# Altium project Notecarrier-XI_V4.PrjPCB
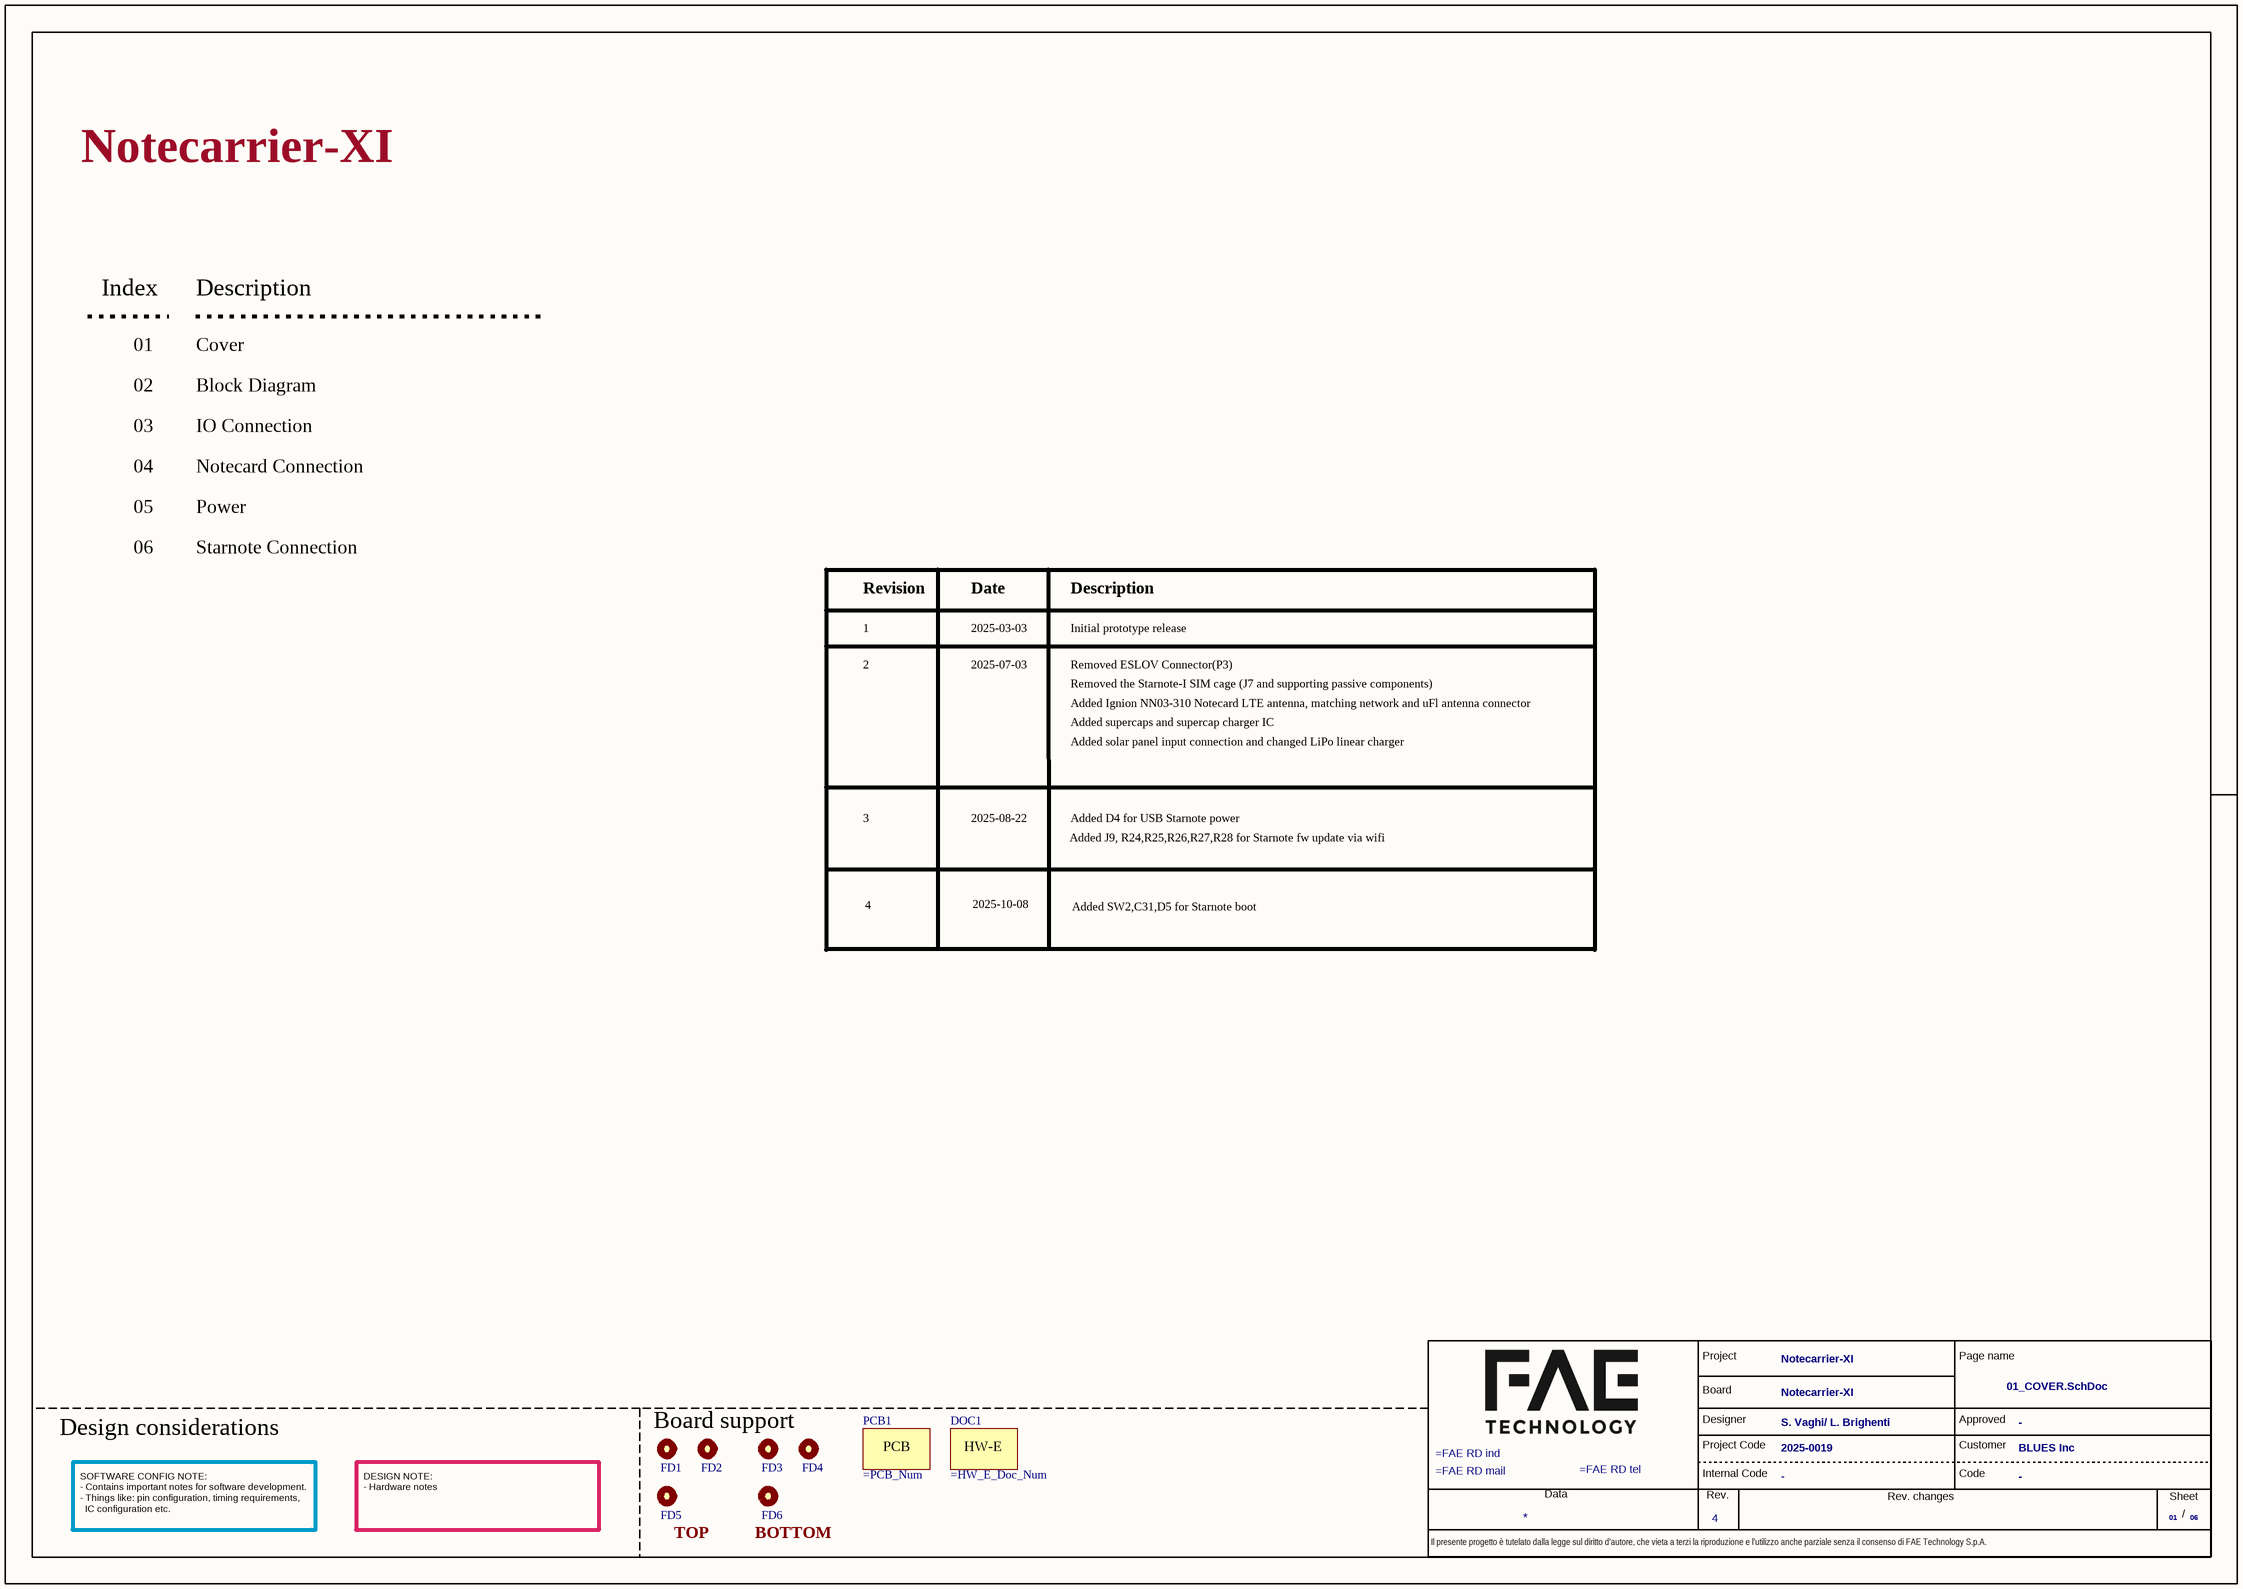
[diagram p0: 01_COVER.SchDoc]
Customer Code: -; Customer name: BLUES Inc; Database: -; FAE RD Code: 2025-0019; Nome Progetto: Notecarrier-XI; PageTotal: 06; Project designer: S. Vaghi/ L. Brighenti; Project Manager: -; Rev: 4; Schematic Name: Notecarrier-XI
5 sheets, 70 parts. Net scope: global (net labels, ports and power ports of the same name join across sheets).
Board file: Notecarrier-XI_V4.PcbDoc
Sheets:
  01_COVER.SchDoc
  02_BLOCK-DIAGRAM.SchDoc
  03_IO-CONNECTION.SchDoc
  04_NOTECARD-CONNECTION.SchDoc
  06_STARNOTE-CONNECTION.SchDoc

## Sheet 01_COVER.SchDoc
size 420 x 297 mm; Web: www.byte-lab.com; PageNumber: 01

### Parts
(Parts that share a designator on the sheet are numbered #1, #2 ... from top to bottom, then left to right.)
?#1  (no value)  (graphical)
DOC1  Electronic design doc number  (value not drawn)  (mechanical)
FD1  Fiducial mark  [Fiducial mark 1mm]  (value not drawn)  (no BOM)
FD2  Fiducial mark  [Fiducial mark 1mm]  (value not drawn)  (no BOM)
FD3  Fiducial mark  [Fiducial mark 1mm]  (value not drawn)  (no BOM)
FD4  Fiducial mark  [Fiducial mark 1mm]  (value not drawn)  (no BOM)
FD5  Fiducial mark  [Fiducial mark 1mm]  (value not drawn)  (no BOM)
FD6  Fiducial mark  [Fiducial mark 1mm]  (value not drawn)  (no BOM)
PCB1  PCB Part Number  (value not drawn)  (mechanical)

### Nets

Not connected (* = marked no-connect by the designer): FD1 1; FD2 1; FD3 1; FD4 1; FD5 1; FD6 1

### Notes on the sheet
- Index
- Description
- 01
- 02
- Cover
- Block Diagram
- 03
- IO Connection
- 04
- 05
- Notecard Connection
- Power
- 06
- Starnote Connection
- Revision
- Date
- 2
- 1
- 2025-07-03
- 2025-03-03
- Removed ESLOV Connector(P3)
- Initial prototype release
- Removed the Starnote-I SIM cage (J7 and supporting passive components)
- Added Ignion NN03-310 Notecard LTE antenna, matching network and uFl antenna connector
- Added supercaps and supercap charger IC
- Added solar panel input connection and changed LiPo linear charger
- 3
- 2025-08-22
- Added J9, R24,R25,R26,R27,R28 for Starnote fw update via wifi
- Added D4 for USB Starnote power
- 4
- 2025-10-08
- Added SW2,C31,D5 for Starnote boot
- Design considerations
- Board support
- SOFTWARE CONFIG NOTE:
  - Contains important notes for software development.
  - Things like: pin configuration, timing requirements,
  IC configuration etc.
- DESIGN NOTE:
  - Hardware notes
- (near FD5) TOP
- (near FD6) BOTTOM
- Board
- Project
- Page name
- Project Code
- Designer
- Internal Code
- Approved
- Customer
- Code
- Il presente progetto è tutelato dalla legge sul diritto d'autore, che vieta a terzi la riproduzione e l'utilizzo anche parziale senza il consenso di FAE Technology S.p.A.
- Data
- Rev.
- Rev. changes
- Sheet
- /
- (in symbol PN_HW-E) HW-E
- (in symbol PN_PCB) PCB

### Library data of the parts
?#1 = MyFAETechnology
DOC1 = PN_HW-E: Manufacturer: Byte Lab; Checked_By: Zvonc; Drawn_By: Dodig; Manufacturer Part Number: *; DateModified: *; BL Part Number: =HW_E_Doc_Num
FD1-FD6 = Fiducial mark: Drawn_By: Puskar; Checked_By: Dodig; BL Part Number: N/A; Manufacturer: N/A; Manufacturer Part Number: N/A; DateModified: 17-06-2013
PCB1 = PN_PCB: Manufacturer: Byte Lab; Checked_By: Zvonc; Drawn_By: Dodig; Manufacturer Part Number: *; DateModified: *; BL Part Number: =PCB_Num

## Sheet 02_BLOCK-DIAGRAM.SchDoc
size 420 x 297 mm; Web: www.byte-lab.com; PageNumber: 02
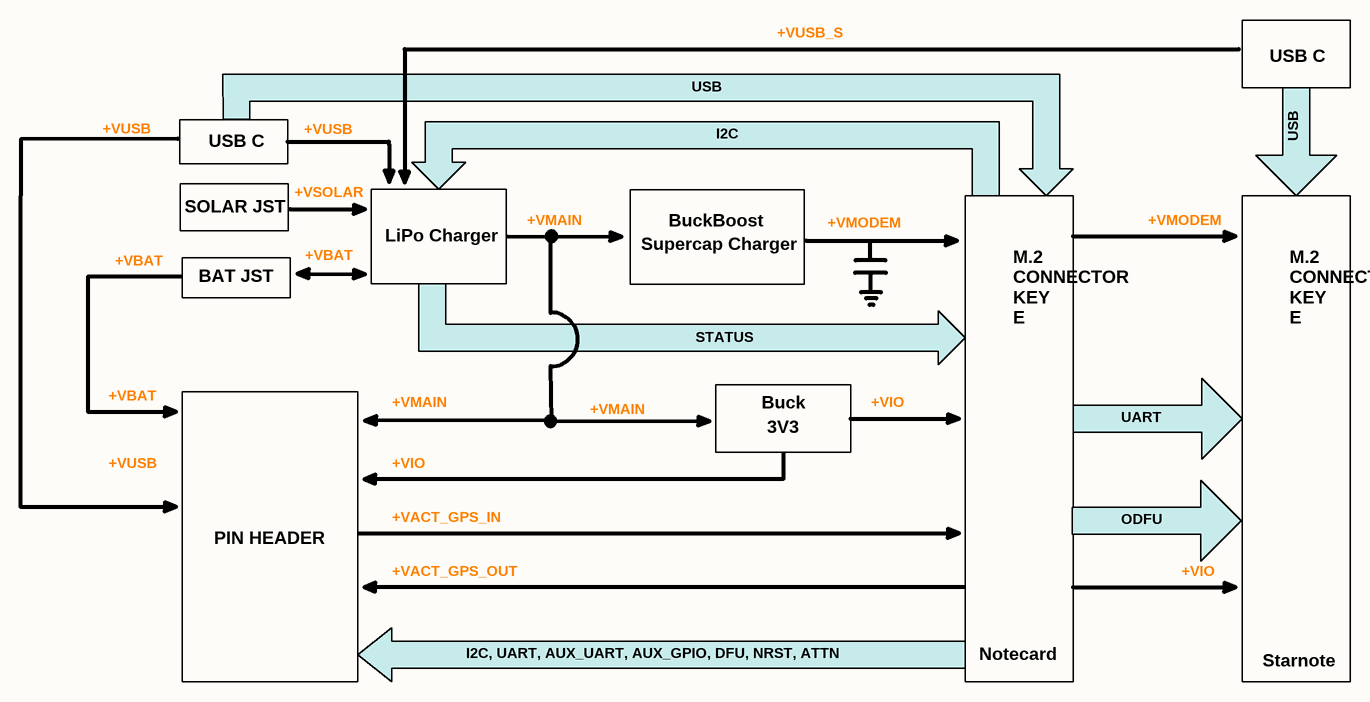
[diagram p1: 02_BLOCK-DIAGRAM.SchDoc]

### Parts
(Parts that share a designator on the sheet are numbered #1, #2 ... from top to bottom, then left to right.)
?#2  (no value)  (graphical)

### Notes on the sheet
- USB
- +VUSB_S
- USB C
- +VUSB
- I2C
- SOLAR JST
- +VSOLAR
- +VMAIN
- BuckBoost
- +VMODEM
- +VBAT
- BAT JST
- LiPo Charger
- Supercap Charger
- STATUS
- Buck
- 3V3
- +VIO
- UART
- +VACT_GPS_IN
- ODFU
- PIN HEADER
- +VACT_GPS_OUT
- M.2 CONNECTOR KEY E
- I2C, UART, AUX_UART, AUX_GPIO, DFU, NRST, ATTN
- Notecard
- Starnote
- Board
- Project
- Page name
- Project Code
- Designer
- Internal Code
- Approved
- Customer
- Code
- Il presente progetto è tutelato dalla legge sul diritto d'autore, che vieta a terzi la riproduzione e l'utilizzo anche parziale senza il consenso di FAE Technology S.p.A.
- Data
- Rev.
- Rev. changes
- Sheet
- /

### Library data of the parts
?#2 = MyFAETechnology

## Sheet 03_IO-CONNECTION.SchDoc
size 420 x 297 mm; Web: www.byte-lab.com; PageNumber: 03
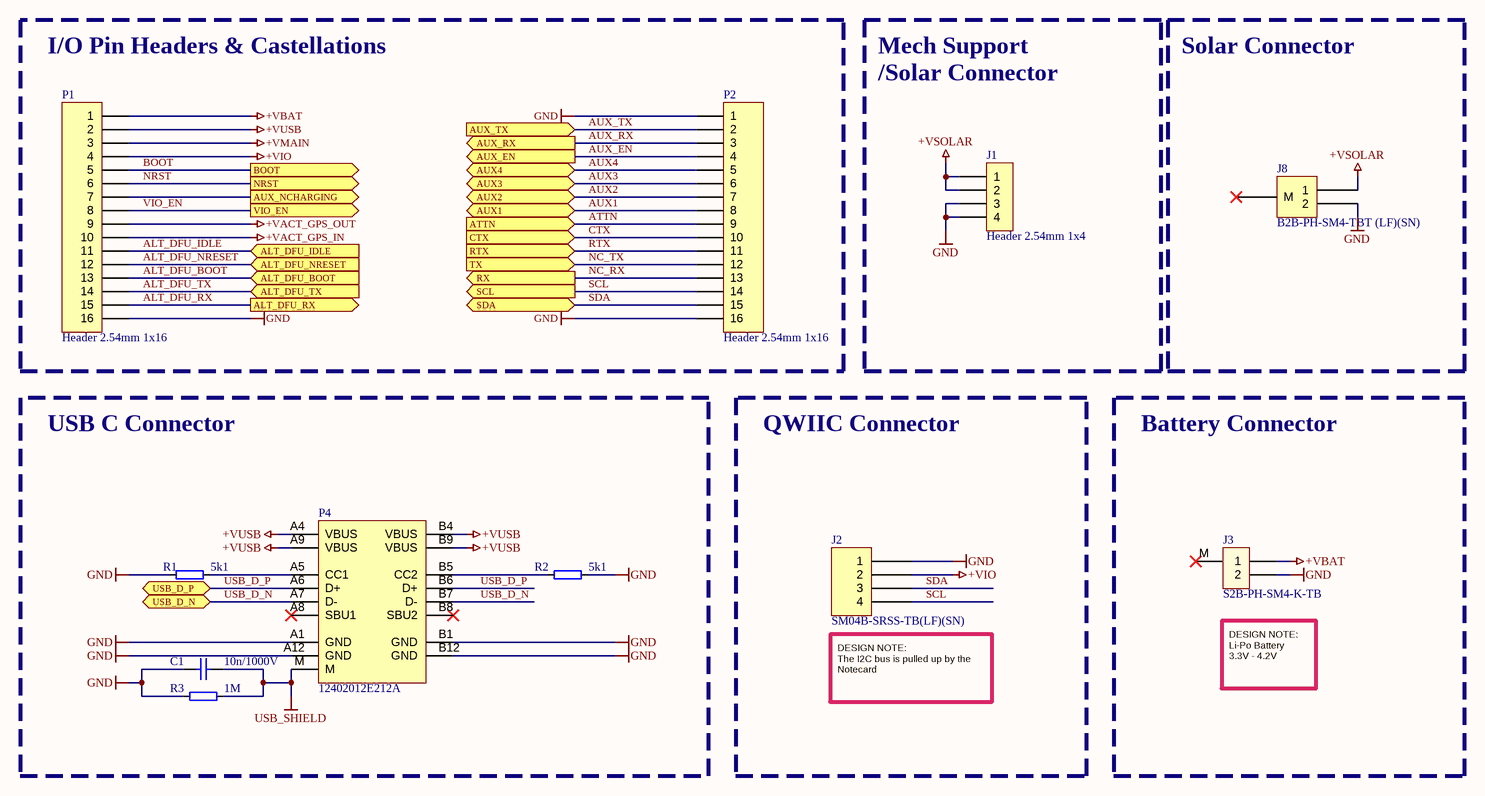
[diagram p2: 03_IO-CONNECTION.SchDoc]

### Parts
(Parts that share a designator on the sheet are numbered #1, #2 ... from top to bottom, then left to right.)
?#3  (no value)  (graphical)
C1  10n/1000V  [C-1206]
J1  Header 2.54mm 1x4  [Header 2.54mm 1X4]
J2  SM04B-SRSS-TB(LF)(SN)  [JST SM04B-SRSS-TB]
J3  S2B-PH-SM4-K-TB  [Conn S2B-PH-SM4]
J8  B2B-PH-SM4-TBT (LF)(SN)  [CONN2_B2B-PH-SM4_JST]
P1  Header 2.54mm 1x16  [Header 2.54mm 1X16]
P2  Header 2.54mm 1x16  [Header 2.54mm 1X16]
P4  12402012E212A  [CONN_12402012E212A]
R1  5k1  [R-0402]
R2  5k1  [R-0402]
R3  1M  [R-1206]

### Blocks framed on the sheet
I/O Pin Headers & Castellations: P1 P2
Solar Connector: J8
USB C Connector: C1 P4 R1-R3
QWIIC Connector: J2
Battery Connector: J3

### Ports
ALT_DFU_BOOT (in), ALT_DFU_IDLE (in), ALT_DFU_NRESET (in), ALT_DFU_RX (out), ALT_DFU_TX (in), ATTN (in), AUX1 (bidir), AUX2 (bidir), AUX3 (bidir), AUX4 (bidir), AUX_EN (out), AUX_NCHARGING (out), AUX_RX (out), AUX_TX (in), BOOT (out), CTX (in), NRST (out), RTX (in), RX (out), SCL (out), SDA (bidir), TX (in), USB_D_N (bidir), USB_D_P (bidir), VIO_EN (out)

### Nets
+VACT_GPS_IN: P1.10
+VACT_GPS_OUT: P1.9
+VBAT: J3.1 P1.1
+VIO: J2.2 P1.4
+VMAIN: P1.3
+VSOLAR: J1.1 J1.2 J8.1
+VUSB: P1.2 P4.A4(VBUS) P4.A9(VBUS) P4.B4(VBUS) P4.B9(VBUS)
GND: C1.2 J1.3 J1.4 J2.1 J3.2 J8.2 P1.16 P2.1 P2.16 P4.A1(GND) P4.A12(GND) P4.B1(GND) P4.B12(GND) R1.1 R2.2 R3.2
USB_SHIELD: C1.1 P4.M R3.1
ALT_DFU_BOOT: P1.13 ; port ALT_DFU_BOOT
ALT_DFU_IDLE: P1.11 ; port ALT_DFU_IDLE
ALT_DFU_NRESET: P1.12 ; port ALT_DFU_NRESET
ALT_DFU_RX: P1.15 ; port ALT_DFU_RX
ALT_DFU_TX: P1.14 ; port ALT_DFU_TX
ATTN: P2.9 ; port ATTN
AUX1: P2.8 ; port AUX1
AUX2: P2.7 ; port AUX2
AUX3: P2.6 ; port AUX3
AUX4: P2.5 ; port AUX4
AUX_EN: P2.4 ; port AUX_EN
AUX_NCHARGING: P1.7 ; port AUX_NCHARGING
AUX_RX: P2.3 ; port AUX_RX
AUX_TX: P2.2 ; port AUX_TX
BOOT: P1.5 ; port BOOT
CTX: P2.10 ; port CTX
NC_RX: P2.13 ; port RX
NC_TX: P2.12 ; port TX
NRST: P1.6 ; port NRST
RTX: P2.11 ; port RTX
SCL: J2.4 P2.14 ; port SCL
SDA: J2.3 P2.15 ; port SDA
USB_D_N: P4.A7(D-) P4.B7(D-) ; port USB_D_N
USB_D_P: P4.A6(D+) P4.B6(D+) ; port USB_D_P
VIO_EN: P1.8 ; port VIO_EN
NetP4_A5: P4.A5(CC1) R1.2
NetP4_B5: P4.B5(CC2) R2.1

Not connected (* = marked no-connect by the designer): J3 M*; J8 M*; P4 A8(SBU1)* B8(SBU2)*

### Notes on the sheet
- Mech Support
- /Solar Connector
- (near J3) DESIGN NOTE:
  Li-Po Battery
  3.3V - 4.2V
- (near J2) DESIGN NOTE:
  The I2C bus is pulled up by the Notecard
- Board
- Project
- Page name
- Project Code
- Designer
- Internal Code
- Approved
- Customer
- Code
- Il presente progetto è tutelato dalla legge sul diritto d'autore, che vieta a terzi la riproduzione e l'utilizzo anche parziale senza il consenso di FAE Technology S.p.A.
- Data
- Rev.
- Rev. changes
- Sheet
- /

### Library data of the parts
?#3 = MyFAETechnology
C1 = C1206-10n-1000V-X7R - CS1206KKX7RCBB103: Capacitor ceramic 10n ±10% X7R 1000V 1206; BL Part Number: 2007-449; Manufacturer: YAGEO; Drawn_By: Hamin; Checked_By: Marsic; Manufacturer Part Number: CS1206KKX7RCBB103; DateModified: 03-05-2023; Supplier 1: Digi-Key; Supplier Part Number 1: 311-3578-1-ND; Note: *
J1 = Conn Header 2.54mm 1X4: 2.54mm pitch 4 pin (1x4) top entry wire to board connector THT; BL Part Number: 2001-524; Manufacturer: Wurth; Manufacturer Part Number: 61300411121; Drawn_By: Puskar; Checked_By: Dodig; Note: *; DateModified: 29-01-2024; Pkg Type: THT
J2 = SM04B-SRSS-TB(LF)(SN): CONN HEADER SH 4POS SIDE 1MM TIN; Manufacturer: JST Sales America Inc.; BL Part Number: 2002-058; Drawn_By: Blues Wireless; Supplier 1: Digi-Key; Manufacturer Part Number: SM04B-SRSS-TB(LF)(SN); Supplier Part Number 1: 455-1804-1-ND
J3 = Conn S2B-PH-SM4-K-TB: 2.00mm pitch 2 pin side entry wire to board connector, SMD; BL Part Number: 2007-662; Manufacturer: JST; Manufacturer Part Number: S2B-PH-SM4-K-TB(LF)(SN); Drawn_By: Hamin; DateModified: 19-06-2023; Checked_By: *; Supplier 1: Digi-Key; Supplier Part Number 1: *; Note: *
J8 = Conn B2B-PH-SM4-TBT (LF)(SN): CONN HEADER SH 2POS VERT 2MM TIN; Manufacturer: JST Sales America Inc.; Pkg Type: SMD; Manufacturer Part Number: B2B-PH-SM4-TBT
P1 P2 = Conn Header 2.54mm 1X16: 2.54mm pitch 16 pin (1x16) top entry wire to board connector THT; BL Part Number: 2001-478; Drawn_By: Puskar; Checked_By: Hamin; Note: *; Manufacturer: N/A; Manufacturer Part Number: N/A; DateModified: 07-12-2013
P4 = Conn USB C 12402012E212A: CONN RCP USB2.0 TYP C 24P SMD RA; BL Part Number: 2008-437; Manufacturer: Amphenol; Drawn_By: Anic-Ivicic; Checked_By: Hlupic; Note: *; Manufacturer Part Number: 12402012E212A; DateModified: 19-03-2024; Supplier 1: Digi-Key; Supplier Part Number 1: 664-12402012E212ATR-ND
R1 R2 = R0402-5k1-1: Resistor 5k1 ±1% 0402; Manufacturer Part Number: RC0402FR-075K1L; Manufacturer: YAGEO; BL Part Number: 2004-098; Checked_By: Hamin; Drawn_By: PuskarJ; Pkg Type: SMD; DateModified: 21-09-2018; Note: *; Supplier 1: Digi-Key; Supplier Part Number 1: P5.10KLCT-ND; Package: 0402
R3 = R1206-1M-1: Resistor 1M ±1% 1206; Manufacturer Part Number: CRG1206F1M0; Manufacturer: TE Connectivity Passive Product; BL Part Number: 2001-438; Checked_By: Golubic; Drawn_By: Zvonc; Pkg Type: SMD; DateModified: 01-07-2014; Package: 1206

## Sheet 04_NOTECARD-CONNECTION.SchDoc
size 420 x 297 mm; Web: www.byte-lab.com; PageNumber: 04
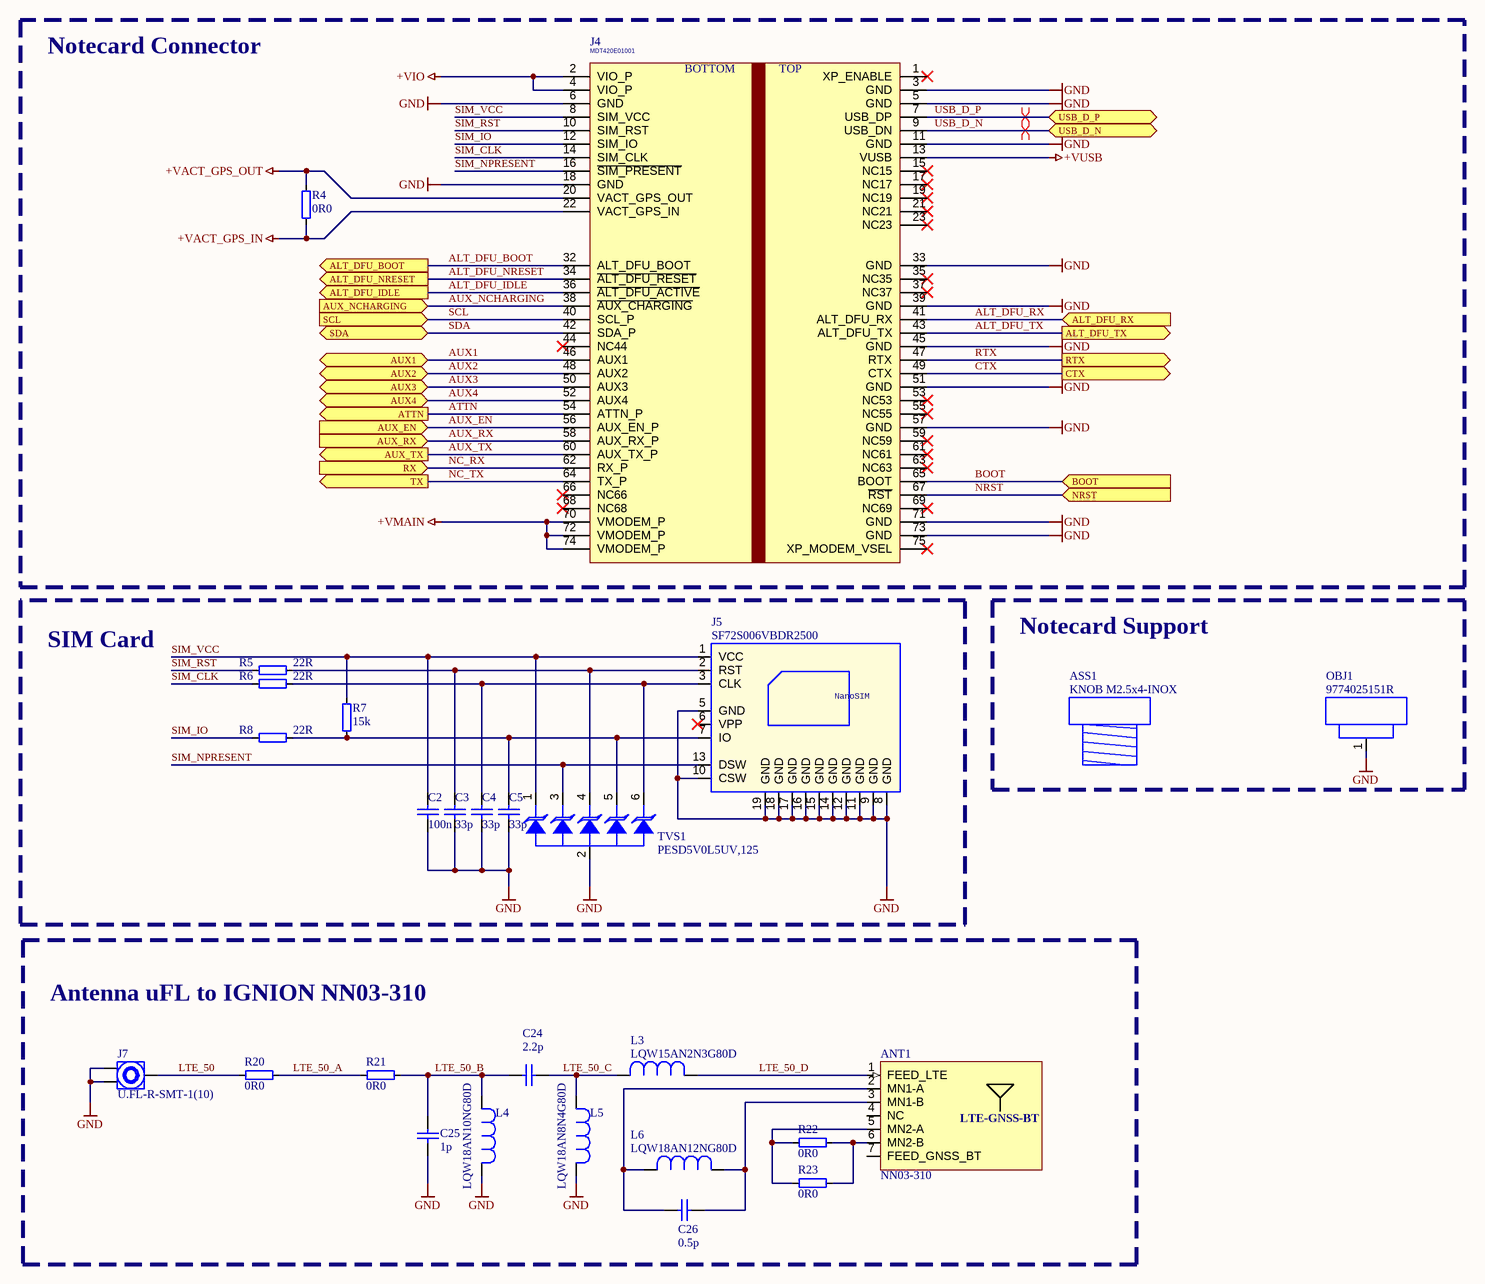
[diagram p3: 04_NOTECARD-CONNECTION.SchDoc]

### Parts
(Parts that share a designator on the sheet are numbered #1, #2 ... from top to bottom, then left to right.)
?#4  (no value)  (graphical)
ANT1  NN03-310  [XCVR_NN03-310]
ASS1  KNOB M2.5x4-INOX  (mechanical)
C2  100n  [C-0402]
C3  33p  [C-0402]
C4  33p  [C-0402]
C5  33p  [C-0402]
C24  2.2p  [MN_0402_0603]
C25  1p  [MN_0402_0603]
C26  0.5p  [MN_0402_0603]
J4  MDT420E01001  [J-75-0050-MOS-M2 - TELITWIFIV2]
J5  SF72S006VBDR2500  [J-NANOSIM-SF72S006VBA]
J7  U.FL-R-SMT-1(10)  [HRS_U.FL-R-SMT-1(10)]
L3  LQW15AN2N3G80D  [MN_0402_0603]
L4  LQW18AN10NG80D  [MN_0402_0603]
L5  LQW18AN8N4G80D  [MN_0402_0603]
L6  LQW18AN12NG80D  [MN_0402_0603]
OBJ1  9774025151R  [DIST-WASMSIM0250]
R4  0R0  [R-0603]
R5  22R  [R-0402]
R6  22R  [R-0402]
R7  15k  [R-0402]
R8  22R  [R-0402]
R20  0R0  [MN_0402_0603]
R21  0R0  [MN_0402_0603]
R22  0R0  [MN_0402_0603]
R23  0R0  [MN_0402_0603]
TVS1  PESD5V0L5UV,125  [SOT666]

### Blocks framed on the sheet
Notecard Connector: J4 R4
SIM Card: C2-C5 J5 R5-R8 TVS1
Notecard Support: ASS1 OBJ1
Antenna uFL to IGNION NN03-310: ANT1 C24-C26 J7 L3-L6 R20-R23

### Ports
ALT_DFU_BOOT (out), ALT_DFU_IDLE (out), ALT_DFU_NRESET (out), ALT_DFU_RX (in), ALT_DFU_TX (out), ATTN (out), AUX1 (bidir), AUX2 (bidir), AUX3 (bidir), AUX4 (bidir), AUX_EN (in), AUX_NCHARGING (in), AUX_RX (in), AUX_TX (out), BOOT (in), CTX (out), NRST (in), RTX (out), RX (in), SCL (in), SDA (bidir), TX (out), USB_D_N (bidir), USB_D_P (bidir)

### Nets
+VACT_GPS_IN: J4.22(VACT_GPS_IN) R4.1
+VACT_GPS_OUT: J4.20(VACT_GPS_OUT) R4.2
+VIO: J4.2(VIO_P) J4.4(VIO_P)
+VMAIN: J4.70(VMODEM_P) J4.72(VMODEM_P) J4.74(VMODEM_P)
+VUSB: J4.13(VUSB)
GND: C2.1 C3.1 C4.1 C5.1 C25.1 J4.3(GND) J4.5(GND) J4.6(GND) J4.11(GND) J4.18(GND) J4.33(GND) J4.39(GND) J4.45(GND) J4.51(GND) J4.57(GND) J4.71(GND) J4.73(GND) J5.5(GND) J5.8(GND) J5.9(GND) J5.10(CSW) J5.11(GND) J5.12(GND) J5.14(GND) J5.15(GND) J5.16(GND) J5.17(GND) J5.18(GND) J5.19(GND) J7.1(GND) J7.3(GND) L4.1 L5.1 OBJ1.1 TVS1.2(A2)
ALT_DFU_BOOT: J4.32(ALT_DFU_BOOT) ; port ALT_DFU_BOOT
ALT_DFU_IDLE: J4.36(~{ALT_DFU_ACTIVE}) ; port ALT_DFU_IDLE
ALT_DFU_NRESET: J4.34(~{ALT_DFU_RESET}) ; port ALT_DFU_NRESET
ALT_DFU_RX: J4.41(ALT_DFU_RX) ; port ALT_DFU_RX
ALT_DFU_TX: J4.43(ALT_DFU_TX) ; port ALT_DFU_TX
ATTN: J4.54(ATTN_P) ; port ATTN
AUX1: J4.46(AUX1) ; port AUX1
AUX2: J4.48(AUX2) ; port AUX2
AUX3: J4.50(AUX3) ; port AUX3
AUX4: J4.52(AUX4) ; port AUX4
AUX_EN: J4.56(AUX_EN_P) ; port AUX_EN
AUX_NCHARGING: J4.38(~{AUX_CHARGING}) ; port AUX_NCHARGING
AUX_RX: J4.58(AUX_RX_P) ; port AUX_RX
AUX_TX: J4.60(AUX_TX_P) ; port AUX_TX
BOOT: J4.65(BOOT) ; port BOOT
CTX: J4.49(CTX) ; port CTX
LTE_50: J7.2(SIG) R20.1
LTE_50_A: R20.2 R21.1
LTE_50_B: C24.2 C25.2 L4.2 R21.2
LTE_50_C: C24.1 L3.2 L5.2
LTE_50_D: ANT1.1(FEED_LTE) L3.1
NC_RX: J4.62(RX_P) ; port RX
NC_TX: J4.64(TX_P) ; port TX
NRST: J4.67(~{RST}) ; port NRST
RTX: J4.47(RTX) ; port RTX
SCL: J4.40(SCL_P) ; port SCL
SDA: J4.42(SDA_P) ; port SDA
SIM_CLK: J4.14(SIM_CLK) R6.1
SIM_IO: J4.12(SIM_IO) R8.1
SIM_NPRESENT: J4.16(~{SIM_PRESENT}) J5.13(DSW) TVS1.3(C3)
SIM_RST: J4.10(SIM_RST) R5.1
SIM_VCC: C2.2 J4.8(SIM_VCC) J5.1(VCC) R7.2 TVS1.1(C1)
USB_D_N: J4.9(USB_DN) ; port USB_D_N
USB_D_P: J4.7(USB_DP) ; port USB_D_P
NetANT1_2: ANT1.2(MN1-A) C26.1 L6.2
NetANT1_3: ANT1.3(MN1-B) C26.2 L6.1
NetANT1_5: ANT1.5(MN2-A) R22.1 R23.1
NetANT1_6: ANT1.6(MN2-B) R22.2 R23.2
NetC3_2: C3.2 J5.2(RST) R5.2 TVS1.4(C4)
NetC4_2: C4.2 J5.3(CLK) R6.2 TVS1.6(C6)
NetC5_2: C5.2 J5.7(IO) R7.1 R8.2 TVS1.5(A5)

Not connected (* = marked no-connect by the designer): ANT1 4(NC) 7(FEED_GNSS_BT); J4 1(XP_ENABLE)* 15(NC15)* 17(NC17)* 19(NC19)* 21(NC21)* 23(NC23)* 35(NC35)* 37(NC37)* 44(NC44)* 53(NC53)* 55(NC55)* 59(NC59)* 61(NC61)* 63(NC63)* 66(NC66)* 68(NC68)* 69(NC69)* 75(XP_MODEM_VSEL)*; J5 6(VPP)*

### Layout directives
differential pair: USB_D_N, USB_D_P

### Notes on the sheet
- Board
- Project
- Page name
- Project Code
- Designer
- Internal Code
- Approved
- Customer
- Code
- Il presente progetto è tutelato dalla legge sul diritto d'autore, che vieta a terzi la riproduzione e l'utilizzo anche parziale senza il consenso di FAE Technology S.p.A.
- Data
- Rev.
- Rev. changes
- Sheet
- /
- (in symbol NANOSIM - J-NANOSIM-SF72S006VBA) NanoSIM
- (in symbol NN03-310) LTE-GNSS-BT
- (in symbol TELITWIFIV2) BOTTOM; TOP

### Library data of the parts
?#4 = MyFAETechnology
ANT1 = NN03-310: Multiport top performance chip antenna component for GSM, UMTS, LTE, 5G, GNSS, Bluetooth (617 - 960MHz, 1710 - 2690MHz, 3300 - 3800MHz, 1561 - 1606 MHz and 2400 - 2500 MHz), signal booster; MF: Ignion; Pkg Type: SMD; SnapEDA_Link: https://www.snapeda.com/parts/NN03-310/Ignion/view-part/?ref=snap; Package: -; Value: *; MP: NN03-310; Check_prices: https://www.snapeda.com/parts/NN03-310/Ignion/view-part/?ref=eda; Manufacturer Part Number: NN03-310; Manufacturer: IGNION
ASS1 = KNOB - M2.5x4-INOX: VITE TCEI 2.5X4 ESAGONO INCASSATO A2 INOX; Manufacturer Part Number: M2.5X4/D7985-A2; Manufacturer: KRAFTBERG; BL Part Number: 6000-168; Drawn_By: Blues Wireless; Supplier Part Number 1: M2.5X4/D7985-A2; Supplier 1: TME; Package: -; Pkg Type: -
C2 = C0402-100n-16V-X7R: Capacitor ceramic 100n ±10% X7R 16V 0402; Manufacturer: Murata Electronics; BL Part Number: 2000-908; Manufacturer Part Number: GRM155R71C104KA88D; Drawn_By: Puskar; Checked_By: Dodig; Pkg Type: SMD; Supplier 1: Digi-Key; Supplier Part Number 1: 490-3261-1-ND; Note: *; DateModified: 27-08-2013; Package: 0402
C3-C5 = C0402-33p-50V-C0G-5: Capacitor ceramic 33p ±5% C0G 50V 0402; Manufacturer: Samsung Electro-Mechanics; BL Part Number: 2001-377; Manufacturer Part Number: CL05C330JB5NNNC; Drawn_By: Puskar; Checked_By: Dodig; Pkg Type: SMD; Supplier 1: Digi-Key; Supplier Part Number 1: 1276-1272-1-ND; Note: *; DateModified: 24-11-2013; Package: 0402
C24 = MN_C0402_0603-2.2p-50V-C0G: Capacitor ceramic 2.2p ±5% C0G 50V 0402; Manufacturer: Murata; Manufacturer Part Number: GJM1555C1H2R2WB01D; Note: *
C25 = MN_C0402_0603-1p-50V-C0G: Capacitor ceramic 1p ±5% C0G 50V 0402; Manufacturer: Murata; Manufacturer Part Number: GJM1555C1H1R0WB01J; Note: *
C26 = MN_C0402_0603-0.5p-50V-C0G: Capacitor ceramic 0.5p ±5% C0G 50V 0402; Manufacturer: Murata; Manufacturer Part Number: GJM1555C1HR50WB01D; Note: *
J4 = TELITWIFIV2: CONN. M.2 75P M/90° P=0.5 MDT420E01001 AMPHENOL SMT; Manufacturer: Amphenol ICC (FCI); Manufacturer Part Number: MDT420E03001; BL Part Number: 2007-460; Drawn_By: Blues Wireless; Supplier 1: Digi-Key; Supplier Part Number 1: MDT420E03001CT-ND
J5 = NANOSIM - J-NANOSIM-SF72S006VBA: CONN. NANOSIM 8P F/90° PUSH-PUSH SF72S006VBAR2500 JAE ELECTRONICS SMT; BL Part Number: 2007-458; Drawn_By: Blues Wireless; Supplier 1: Digi-Key; Supplier Part Number 1: 670-2967-1-ND; Manufacturer Part Number: SF72S006VBDR2500; Manufacturer: JAE Electronics
J7 = U.FL-R-SMT-1(10): U.FL Series 6 Ghz 50 Ohm Ultra-small SMT Coaxial Cable Receptacle; Manufacturer: Hirose; Pkg Type: SMD; Availability: Unavailable; Value: *; Price: None; Package: -; Manufacturer Part Number: U.FL-R-SMT-1(10)
L3 = MN_L0402_0603-2.3nH: 2.3 nH Inductor 2.53 A 22mOhm Max 0402; Manufacturer: Murata; Manufacturer Part Number: LQW15AN2N3G80D
L4 = MN_L0402_0603-10nH: 10 nH Inductor 1.6 A 52mOhm Max 0603; Manufacturer: Murata; Manufacturer Part Number: LQW18AN10NG80D
L5 = MN_L0402_0603-8.4nH: 8.4 nH Inductor 1.6 A 52mOhm Max 0603; Manufacturer: Murata; Manufacturer Part Number: LQW18AN8N4G80D
L6 = MN_L0402_0603-12nH: 12 nH Inductor 1.6 A 52mOhm Max 0603; Manufacturer: Murata; Manufacturer Part Number: LQW18AN12NG80D
OBJ1 = DISTANZIALE - M2.5x0250: DISTANZ. CIL. METALLO 5.1X2.5 9774025151R W.E SMT; Manufacturer: Würth Elektronik; BL Part Number: 6020-113; Drawn_By: Blues Wieless; Supplier 1: Digi-Key; Supplier Part Number 1: 732-7078-1-ND; Manufacturer Part Number: 9774025151R
R4 = R0603-0R0: Resistor 0R0 0603; Manufacturer Part Number: RC0603JR-070RL; Manufacturer: YAGEO; BL Part Number: 2000-723; Checked_By: Puskar; Drawn_By: Dodig; Pkg Type: SMD; DateModified: 07-12-2013; Note: *; Package: 0603
R5 R6 R8 = R0402-22R-1: Resistor 22R ±1% 0402; Manufacturer: YAGEO; Manufacturer Part Number: RC0402FR-0722RL; BL Part Number: 2001-170; Checked_By: Hamin; Drawn_By: Zvonc; Pkg Type: SMD; Supplier 1: Digi-Key; Supplier Part Number 1: 311-22.0LRCT-ND; DateModified: 13-02-2021; Note: *; Package: 0402
R7 = R0402-15k-1: Resistor 15k ±1% 0402; Manufacturer: Panasonic Electronic Components; Manufacturer Part Number: ERJ-2RKF1502X; BL Part Number: 2001-157; Checked_By: Zvonc; Drawn_By: Puskar; Pkg Type: SMD; Supplier 1: Digi-Key; Supplier Part Number 1: P15.0KLCT-ND; DateModified: 23-01-2015; Note: *; Package: 0402
R20-R23 = MN_R0603-0R0: Resistor 0R0 0603; Manufacturer Part Number: RC0603JR-070RL; Manufacturer: YAGEO; Pkg Type: SMD
TVS1 = PESD5V0L5UV,125: PESD Series 25 W 5 V Uni-Directional Fivefold ESD Protection Diode Array SOT-666; Manufacturer: Nexperia; BL Part Number: 2007-452; Drawn_By: Blues Wireless; Supplier 1: Digi-Key; Manufacturer Part Number: PESD5V0L5UV,125; Supplier Part Number 1: 1727-5797-1-ND

## Sheet 06_STARNOTE-CONNECTION.SchDoc
size 420 x 297 mm; Web: www.byte-lab.com; PageNumber: 06
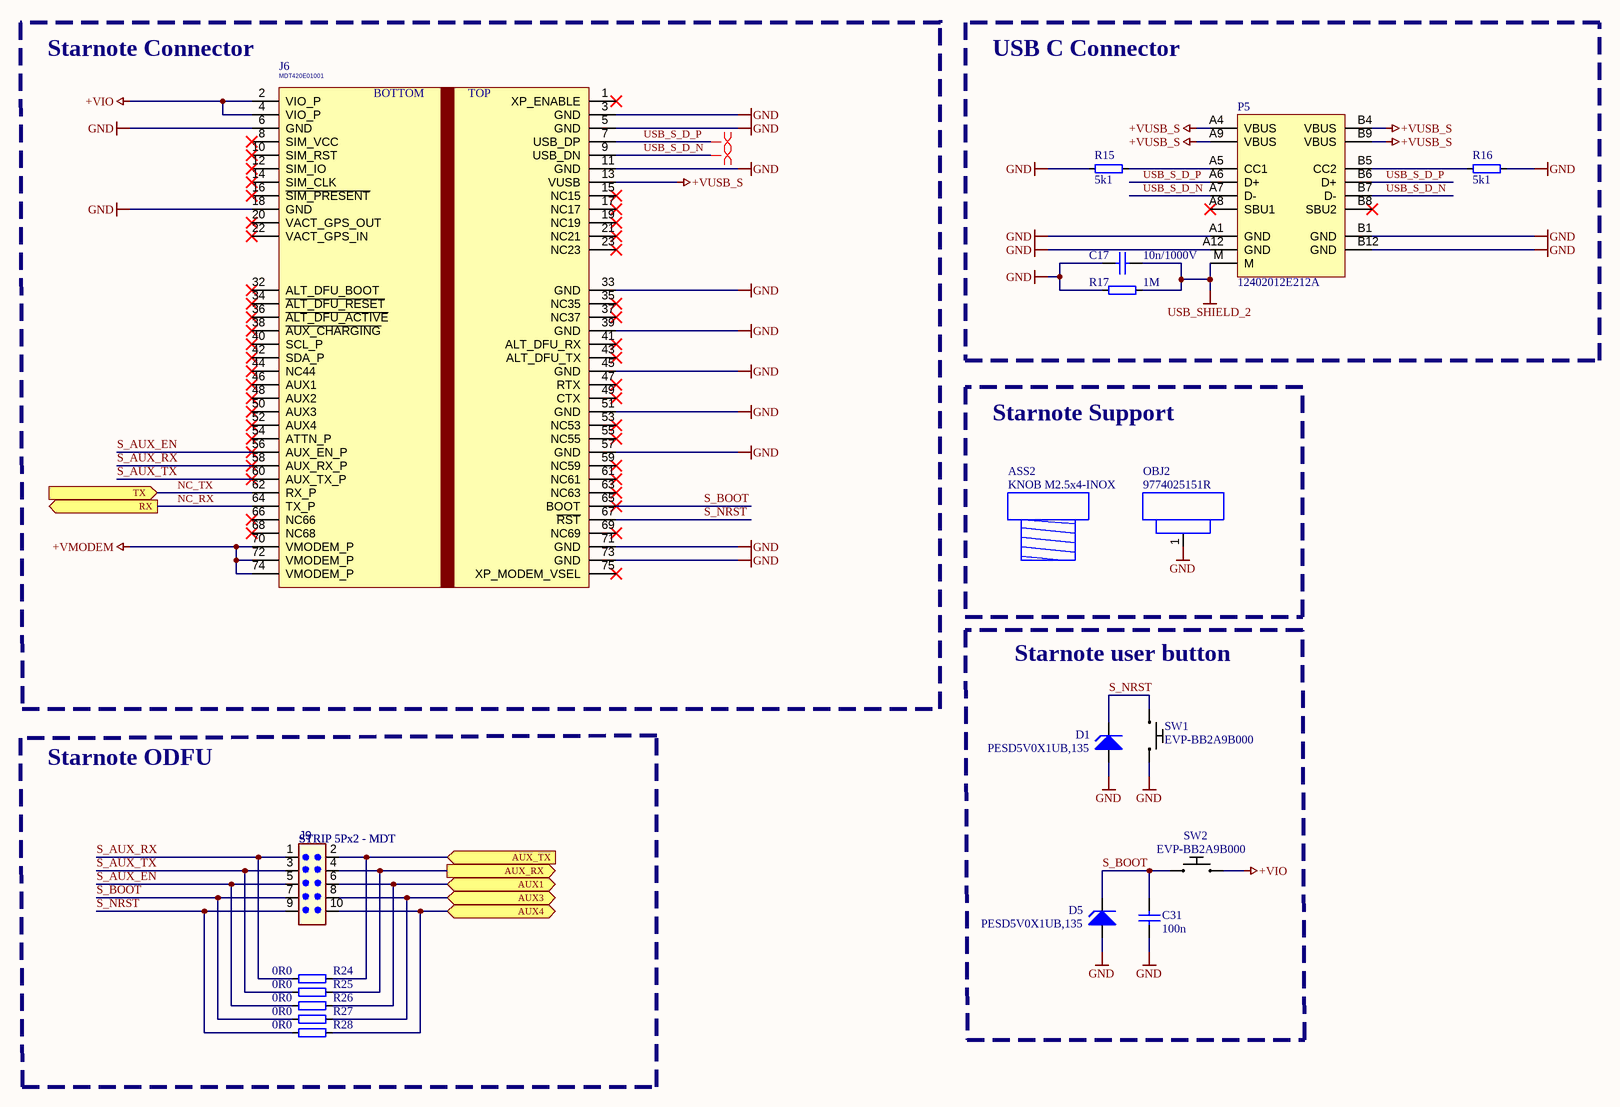
[diagram p4: 06_STARNOTE-CONNECTION.SchDoc]

### Parts
(Parts that share a designator on the sheet are numbered #1, #2 ... from top to bottom, then left to right.)
?#5  (no value)  (graphical)
ASS2  KNOB M2.5x4-INOX  (mechanical)
C17  10n/1000V  [C-1206]
C31  100n  [C-0402]
D1  PESD5V0X1UB,135  [SOD-523F]
D5  PESD5V0X1UB,135  [SOD-523F]
J6  MDT420E01001  [J-75-0050-MOS-M2 - STARNOTEIV3]
J9  STRIP 5Px2 - MDT  [J-5X2-0254-MDT]
OBJ2  9774025151R  [DIST-WASMSIM0250]
P5  12402012E212A  [CONN_12402012E212A]
R15  5k1  [R-0402]
R16  5k1  [R-0402]
R17  1M  [R-1206]
R24  0R0  [R-0603]
R25  0R0  [R-0603]
R26  0R0  [R-0603]
R27  0R0  [R-0603]
R28  0R0  [R-0603]
SW1  EVP-BB2A9B000  [SW_EVP-BB2A9B000]
SW2  EVP-BB2A9B000  [SW_EVP-BB2A9B000]

### Blocks framed on the sheet
USB C Connector: C17 P5 R15-R17
Starnote Support: ASS2 OBJ2
Starnote user button: C31 D1 D5 SW1 SW2
Starnote ODFU: J9 R24-R28

### Ports
AUX1 (bidir), AUX3 (bidir), AUX4 (bidir), AUX_RX (out), AUX_TX (in), RX (out), TX (in)

### Nets
+VIO: J6.2(VIO_P) J6.4(VIO_P) SW2.2(B)
+VMODEM: J6.70(VMODEM_P) J6.72(VMODEM_P) J6.74(VMODEM_P)
+VUSB_S: J6.13(VUSB) P5.A4(VBUS) P5.A9(VBUS) P5.B4(VBUS) P5.B9(VBUS)
GND: C17.2 C31.2 D1.1(A) D5.1(A) J6.3(GND) J6.5(GND) J6.6(GND) J6.11(GND) J6.18(GND) J6.33(GND) J6.39(GND) J6.45(GND) J6.51(GND) J6.57(GND) J6.71(GND) J6.73(GND) OBJ2.1 P5.A1(GND) P5.A12(GND) P5.B1(GND) P5.B12(GND) R15.1 R16.2 R17.2 SW1.2(B)
USB_SHIELD_2: C17.1 P5.M R17.1
AUX1: J9.6 R26.2 ; port AUX1
AUX3: J9.8 R27.2 ; port AUX3
AUX4: J9.10 R28.2 ; port AUX4
AUX_RX: J9.4 R25.2 ; port AUX_RX
AUX_TX: J9.2 R24.2 ; port AUX_TX
NC_RX: J6.64(TX_P) ; port RX
NC_TX: J6.62(RX_P) ; port TX
S_AUX_EN: J6.56(AUX_EN_P) J9.5 R26.1
S_AUX_RX: J6.58(AUX_RX_P) J9.1 R24.1
S_AUX_TX: J6.60(AUX_TX_P) J9.3 R25.1
S_BOOT: C31.1 D5.2(K) J6.65(BOOT) J9.7 R27.1 SW2.1(A)
S_NRST: D1.2(K) J6.67(~{RST}) J9.9 R28.1 SW1.1(A)
USB_S_D_N: J6.9(USB_DN) P5.A7(D-) P5.B7(D-)
USB_S_D_P: J6.7(USB_DP) P5.A6(D+) P5.B6(D+)
NetP5_A5: P5.A5(CC1) R15.2
NetP5_B5: P5.B5(CC2) R16.1

Not connected (* = marked no-connect by the designer): J6 1(XP_ENABLE)* 8(SIM_VCC)* 10(SIM_RST)* 12(SIM_IO)* 14(SIM_CLK)* 15(NC15)* 16(~{SIM_PRESENT})* 17(NC17)* 19(NC19)* 20(VACT_GPS_OUT)* 21(NC21)* 22(VACT_GPS_IN)* 23(NC23)* 32(ALT_DFU_BOOT)* 34(~{ALT_DFU_RESET})* 35(NC35)* 36(~{ALT_DFU_ACTIVE})* 37(NC37)* 38(~{AUX_CHARGING})* 40(SCL_P)* 41(ALT_DFU_RX)* 42(SDA_P)* 43(ALT_DFU_TX)* 44(NC44)* 46(AUX1)* 47(RTX)* 48(AUX2)* 49(CTX)* 50(AUX3)* 52(AUX4)* 53(NC53)* 54(ATTN_P)* 55(NC55)* 59(NC59)* 61(NC61)* 63(NC63)* 66(NC66)* 68(NC68)* 69(NC69)* 75(XP_MODEM_VSEL)*; P5 A8(SBU1)* B8(SBU2)*

### Layout directives
differential pair: USB_S_D_N, USB_S_D_P

### Notes on the sheet
- (near J6) Starnote Connector
- Board
- Project
- Page name
- Project Code
- Designer
- Internal Code
- Approved
- Customer
- Code
- Il presente progetto è tutelato dalla legge sul diritto d'autore, che vieta a terzi la riproduzione e l'utilizzo anche parziale senza il consenso di FAE Technology S.p.A.
- Data
- Rev.
- Rev. changes
- Sheet
- /
- (in symbol STARNOTEI-V3) BOTTOM; TOP

### Library data of the parts
?#5 = MyFAETechnology
ASS2 = KNOB - M2.5x4-INOX: as ASS1 on sheet 04_NOTECARD-CONNECTION; Supplier Part Number 1: M2.5X4/D7985-A2; Supplier 1: TME
C17 = C1206-10n-1000V-X7R - CS1206KKX7RCBB103: as C1 on sheet 03_IO-CONNECTION; Manufacturer Part Number: CS1206KKX7RCBB103; DateModified: 03-05-2023; Supplier 1: Digi-Key; Supplier Part Number 1: 311-3578-1-ND; Note: *
C31 = C0402-100n-16V-X7R: Capacitor ceramic 100n ±10% X7R 16V 0402; BL Part Number: 2000-908; Manufacturer: Murata Electronics; Manufacturer Part Number: GRM155R71C104KA88D; Drawn_By: Puskar; Checked_By: Dodig; Pkg Type: SMD; DateModified: 27-08-2013; Supplier 1: Digi-Key; Supplier Part Number 1: 490-3261-1-ND; Note: *; Package: 0402
D1 D5 = PESD5V0X1UB,135: TVS DIODE 5VWM 8VC SOD523; BL Part Number: 2004-110; Manufacturer: Nexperia; Drawn_By: Zvonc; Checked_By: Hamin; Manufacturer Part Number: PESD5V0X1UB,135; DateModified: 17-10-2018; Supplier 1: Digi-Key; Supplier Part Number 1: 1727-5906-1-ND
J6 = STARNOTEI-V3: CONN. M.2 75P M/90° P=0.5 MDT420E01001 AMPHENOL SMT; Manufacturer: Amphenol ICC (FCI); Manufacturer Part Number: MDT420E03001; BL Part Number: 2007-460; Drawn_By: Blues Wireless; Supplier 1: Digi-Key; Supplier Part Number 1: MDT420E03001CT-ND
J9 = STRIP-J-5X2-0254-MDT: STRIP 2P M/D DOPPIA FILA P=2.54 DORATO CH81802V100; MPN: TSW-105-07-F-D; Manufacturer: Samtec; Pkg Type: THT; Famiglia: CONNETTORE; Database: 01688; Caratteristiche: 5x2P; Price Distributor Cad: 0,002; Modello: STRIP; Distributor: FAE; Value: STRIP 5Px2 - MDT
OBJ2 = DISTANZIALE - M2.5x0250: as OBJ1 on sheet 04_NOTECARD-CONNECTION; Supplier 1: Digi-Key; Supplier Part Number 1: 732-7078-1-ND; Manufacturer Part Number: 9774025151R
P5 = Conn USB C 12402012E212A: as P4 on sheet 03_IO-CONNECTION; Note: *; Manufacturer Part Number: 12402012E212A; DateModified: 19-03-2024; Supplier 1: Digi-Key; Supplier Part Number 1: 664-12402012E212ATR-ND
R15 R16 = R0402-5k1-1: as R1 on sheet 03_IO-CONNECTION; DateModified: 21-09-2018; Note: *; Supplier 1: Digi-Key; Supplier Part Number 1: P5.10KLCT-ND; Package: 0402
R17 = R1206-1M-1: as R3 on sheet 03_IO-CONNECTION; DateModified: 01-07-2014; Package: 1206
R24-R28 = R0603-0R0: as R4 on sheet 04_NOTECARD-CONNECTION; DateModified: 07-12-2013; Note: *; Package: 0603
SW1 SW2 = Switch tact EVP-BB2A9B000: SWITCH TACTILE SPST-NO 0.05A 15V; Manufacturer: Panasonic Electronic Components; BL Part Number: 2007-124; Drawn_By: Marsic; Manufacturer Part Number: EVP-BB2A9B000; Note: *; DateModified: 09-02-2023; Checked_By: *

## Nets that join several sheets
+VACT_GPS_IN: 03_IO-CONNECTION (P1.10), 04_NOTECARD-CONNECTION (J4.22 R4.1)
+VACT_GPS_OUT: 03_IO-CONNECTION (P1.9), 04_NOTECARD-CONNECTION (J4.20 R4.2)
+VIO: 03_IO-CONNECTION (J2.2 P1.4), 04_NOTECARD-CONNECTION (J4.2 J4.4), 06_STARNOTE-CONNECTION (J6.2 J6.4 SW2.2)
+VMAIN: 03_IO-CONNECTION (P1.3), 04_NOTECARD-CONNECTION (J4.70 J4.72 J4.74)
+VUSB: 03_IO-CONNECTION (5 pins), 04_NOTECARD-CONNECTION (J4.13)
GND: 03_IO-CONNECTION (16 pins), 04_NOTECARD-CONNECTION (35 pins), 06_STARNOTE-CONNECTION (25 pins)
ALT_DFU_BOOT: 03_IO-CONNECTION (P1.13), 04_NOTECARD-CONNECTION (J4.32)
ALT_DFU_IDLE: 03_IO-CONNECTION (P1.11), 04_NOTECARD-CONNECTION (J4.36)
ALT_DFU_NRESET: 03_IO-CONNECTION (P1.12), 04_NOTECARD-CONNECTION (J4.34)
ALT_DFU_RX: 03_IO-CONNECTION (P1.15), 04_NOTECARD-CONNECTION (J4.41)
ALT_DFU_TX: 03_IO-CONNECTION (P1.14), 04_NOTECARD-CONNECTION (J4.43)
ATTN: 03_IO-CONNECTION (P2.9), 04_NOTECARD-CONNECTION (J4.54)
AUX1: 03_IO-CONNECTION (P2.8), 04_NOTECARD-CONNECTION (J4.46), 06_STARNOTE-CONNECTION (J9.6 R26.2)
AUX2: 03_IO-CONNECTION (P2.7), 04_NOTECARD-CONNECTION (J4.48)
AUX3: 03_IO-CONNECTION (P2.6), 04_NOTECARD-CONNECTION (J4.50), 06_STARNOTE-CONNECTION (J9.8 R27.2)
AUX4: 03_IO-CONNECTION (P2.5), 04_NOTECARD-CONNECTION (J4.52), 06_STARNOTE-CONNECTION (J9.10 R28.2)
AUX_EN: 03_IO-CONNECTION (P2.4), 04_NOTECARD-CONNECTION (J4.56)
AUX_NCHARGING: 03_IO-CONNECTION (P1.7), 04_NOTECARD-CONNECTION (J4.38)
AUX_RX: 03_IO-CONNECTION (P2.3), 04_NOTECARD-CONNECTION (J4.58), 06_STARNOTE-CONNECTION (J9.4 R25.2)
AUX_TX: 03_IO-CONNECTION (P2.2), 04_NOTECARD-CONNECTION (J4.60), 06_STARNOTE-CONNECTION (J9.2 R24.2)
BOOT: 03_IO-CONNECTION (P1.5), 04_NOTECARD-CONNECTION (J4.65)
CTX: 03_IO-CONNECTION (P2.10), 04_NOTECARD-CONNECTION (J4.49)
NC_RX: 03_IO-CONNECTION (P2.13), 04_NOTECARD-CONNECTION (J4.62), 06_STARNOTE-CONNECTION (J6.64)
NC_TX: 03_IO-CONNECTION (P2.12), 04_NOTECARD-CONNECTION (J4.64), 06_STARNOTE-CONNECTION (J6.62)
NRST: 03_IO-CONNECTION (P1.6), 04_NOTECARD-CONNECTION (J4.67)
RTX: 03_IO-CONNECTION (P2.11), 04_NOTECARD-CONNECTION (J4.47)
SCL: 03_IO-CONNECTION (J2.4 P2.14), 04_NOTECARD-CONNECTION (J4.40)
SDA: 03_IO-CONNECTION (J2.3 P2.15), 04_NOTECARD-CONNECTION (J4.42)
USB_D_N: 03_IO-CONNECTION (P4.A7 P4.B7), 04_NOTECARD-CONNECTION (J4.9)
USB_D_P: 03_IO-CONNECTION (P4.A6 P4.B6), 04_NOTECARD-CONNECTION (J4.7)

## Assembly variants
Notecarrier XI: not fitted DOC1 J9 P1 P2 R4